# Altium schematic sheet CurrentSense.SchDoc
size A4
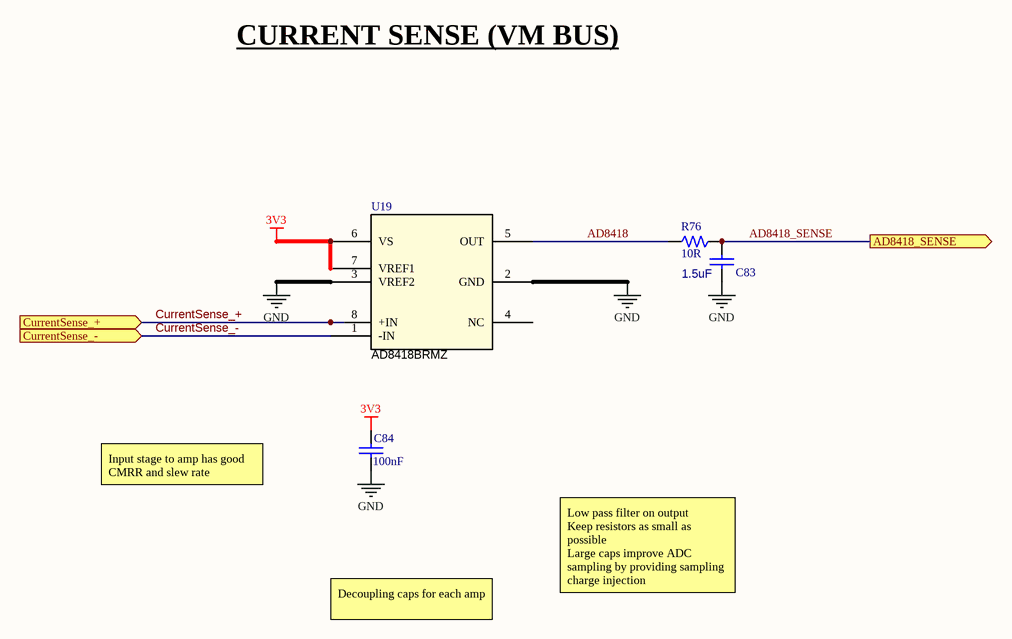
[diagram p0: CurrentSense.SchDoc]

## Parts
C83  Capacitance: 1.5uF  [CAP0402]  (hidden comment: Capacitor)
C84  Capacitance: 100nF  [CAP0402]  (hidden comment: Capacitor)
R76  Resistance: 10R  [RES0402]  (hidden comment: Resistor)
U19  Current Sense  [AD8418BRMZ]  (value not drawn)

## Ports
AD8418_SENSE (out), CurrentSense_+ (in), CurrentSense_- (in)

## Nets
3V3: C84.1 U19.6(VS) U19.7(VREF1)
GND: C83.2 C84.2 U19.2(GND) U19.3(VREF2)
AD8418: R76.2 U19.5(OUT)
AD8418_SENSE: C83.1 R76.1 ; port AD8418_SENSE
CurrentSense_+: U19.8(+IN) ; port CurrentSense_+
CurrentSense_-: U19.1(-IN) ; port CurrentSense_-

Not connected (* = marked no-connect by the designer): U19 4(NC)

## Notes on the sheet
- CURRENT SENSE (VM BUS)
- Input stage to amp has good CMRR and slew rate
- Decoupling caps for each amp
- Low pass filter on output
  Keep resistors as small as possible
  Large caps improve ADC sampling by providing sampling charge injection

## Library data of the parts
C83 = Capacitor: CAP CER 1.5UF 35V X5R 0402; Manufacturer 1: TDK; Manufacturer Part Number 1: C1005X5R1V155K050BC; Dielectric Material: Ceramic; Manufacturer: *; Manufacturer Part Number: *; Supplier: *; Supplier Part Number: *; Tolerance: *; Voltage: *; Footprint: *; Temperature Coefficient: *; Supplier 1: Digi-Key; Supplier Part Number 1: 445-13860-1-ND; RoHS: Yes; Category: Ceramic Capacitors; Stock 1: 9270; Pricing 1: 1=0,37000, 10=0,25800, 50=0,18100, 100=0,15510, 500=0,11632, 1000=0,09823, 2500=0,09306, 5000=0,08789 (USD); Mount: Surface Mount; Case/Package: 0402; Case Code (Metric): 1005; Case Code (Imperial): 0402; Weight: 0.001199oz; Min Operating Temperature: -55°C; Max Operating Temperature: 85°C; Package Quantity: 10000; Packaging: Tape and Reel; Voltage Rating: 35V; Dielectric: X5R; Termination: SMD/SMT; Resistor Type: Ceramic; Voltage Rating (DC): 35V; Series: C; Length: 0.039inch; Width: 0.5mm; Height: 0.5mm; Thickness: 0.022inch; Lead Free: Lead Free; RoHS Compliant: Yes; ComponentLink1URL: https://datasheet.ciiva.com/14896/tdkmlcccaprange-14896024.pdf?src-supplier=Digi-Key; ComponentLink1Description: https://datasheet.ciiva.com/14896/tdkmlcccaprange-14896024.pdf?src-supplier=Digi-Key; ComponentLink2URL: https://datasheet.ciiva.com/14896/tdkmlcccaprange-14896026.pdf?src-supplier=Digi-Key; ComponentLink2Description: https://datasheet.ciiva.com/14896/tdkmlcccaprange-14896026.pdf?src-supplier=Digi-Key; ComponentLink3URL: https://datasheet.ciiva.com/14896/tdkmlcccaprange-14896025.pdf?src-supplier=Digi-Key; ComponentLink3Description: https://datasheet.ciiva.com/14896/tdkmlcccaprange-14896025.pdf?src-supplier=Digi-Key
C84 = Capacitor: Manufacturer: TDK; Manufacturer Part Number: CGA2B3X7R1H104K050BB; Voltage Rating: 50V; Tolerance: 10%; Dielectric: X7R; Supplier 1: Digi-Key; Supplier Part Number 1: 445-6899-1-ND; Stock 1: 14098587; Mount: Surface Mount; Case/Package: 0402; Weight: 2.3E-05oz; Case Code (Metric): 1005; Case Code (Imperial): 0402; Min Operating Temperature: -55°C; Max Operating Temperature: 125°C; Packaging: Tape and Reel; Package Quantity: 1; Voltage Rating (DC): 50V; Termination: SMD/SMT; Composition: Ceramic; Voltage: 50V; Length: 1mm; Height: 0.5mm; Width: 0.02inch; Thickness: 0.022inch; Depth: 0.5mm; Ratings: AEC-Q200; REACH SVHC: No SVHC; Lead Free: Lead Free; ComponentLink1URL: http://product.tdk.com/capacitor/mlcc/en/documents/mlccspec_automotive_general_midvoltage_en.pdf?src-supplier=Future+Electronics; ComponentLink1Description: http://product.tdk.com/capacitor/mlcc/en/documents/mlccspec_automotive_general_midvoltage_en.pdf?src-supplier=Future+Electronics; ComponentLink2URL: http://www.farnell.com/datasheets/1807242.pdf?src-supplier=Element14; ComponentLink2Description: http://www.farnell.com/datasheets/1807242.pdf?src-supplier=Element14; ComponentLink3URL: http://www.mouser.com/ds/2/400/lcc_automotive_general_en-843974.pdf?src-supplier=Mouser; ComponentLink3Description: http://www.mouser.com/ds/2/400/lcc_automotive_general_en-843974.pdf?src-supplier=Mouser; ComponentLink4URL: http://www.farnell.com/datasheets/1936565.pdf?src-supplier=Element14; ComponentLink4Description: http://www.farnell.com/datasheets/1936565.pdf?src-supplier=Element14; ComponentLink5URL: http://www.farnell.com/datasheets/1735392.pdf?src-supplier=Element14; ComponentLink5Description: http://www.farnell.com/datasheets/1735392.pdf?src-supplier=Element14
R76 = Resistor: Manufacturer 1: Panasonic; Manufacturer Part Number 1: ERJ-2RKF10R0X; Tolerance: 1%; Temperature Coefficient: 100ppm/°C; Power Rating: 100mW; Voltage Rating: 50V; Supplier 1: Digi-Key; Supplier Part Number 1: P10.0LDKR-ND; Stock 1: 5683093; Pricing 1: 1=0,10000, 10=0,04800, 100=0,01960, 1000=0,00882, 2500=0,00766, 5000=0,00633 (USD); RoHS: Yes; Mount: Surface Mount; Case/Package: 0402; Number of Pins: 2; Contact Plating: Tin; Case Code (Imperial): 0402; Case Code (Metric): 1005; Min Operating Temperature: -55°C; Max Operating Temperature: 155°C; Composition: Thick Film; Packaging: Tape and Reel; Package Quantity: 1; Termination: SMD/SMT; Number of Terminations: 2; Military Standard: Not; Max Power Dissipation: 100mW; Voltage Rating (DC): 50V; Features: Automotive AEC-Q200; Length: 1mm; Height: 0.35mm; Width: 0.5mm; Depth: 0.5mm; Radiation Hardening: No; REACH SVHC: No SVHC; Lead Free: Lead Free; ComponentLink1URL: https://datasheet.ciiva.com/11821/0900766b80f80784-11821168.pdf?src-supplier=RSComponents; ComponentLink1Description: https://datasheet.ciiva.com/11821/0900766b80f80784-11821168.pdf?src-supplier=RSComponents; ComponentLink2URL: https://datasheet.ciiva.com/7802/aoa0000ce2-7802405.pdf?src-supplier=Element14; ComponentLink2Description: https://datasheet.ciiva.com/7802/aoa0000ce2-7802405.pdf?src-supplier=Element14; ComponentLink3URL: https://datasheet.ciiva.com/16773/70260748-16773366.pdf?src-supplier=Allied+Electronics; ComponentLink3Description: https://datasheet.ciiva.com/16773/70260748-16773366.pdf?src-supplier=Allied+Electronics; ComponentLink4URL: https://datasheet.ciiva.com/43467/1678782-43467127.pdf?src-supplier=Farnell; ComponentLink4Description: https://datasheet.ciiva.com/43467/1678782-43467127.pdf?src-supplier=Farnell; ComponentLink5URL: https://datasheet.ciiva.com/9194/aoa0000ce2-9194120.pdf?src-supplier=Avnet; ComponentLink5Description: https://datasheet.ciiva.com/9194/aoa0000ce2-9194120.pdf?src-supplier=Avnet; ComponentLink6URL: https://datasheet.ciiva.com/30218/aoa0000ce2-30218536.pdf?src-supplier=Onlinecomponents.com; ComponentLink6Description: https://datasheet.ciiva.com/30218/aoa0000ce2-30218536.pdf?src-supplier=Onlinecomponents.com; ComponentLink7URL: https://datasheet.ciiva.com/17212/aoa0000ce2-17212057.pdf?src-supplier=Avnet+Europe; ComponentLink7Description: https://datasheet.ciiva.com/17212/aoa0000ce2-17212057.pdf?src-supplier=Avnet+Europe; ComponentLink8URL: https://datasheet.ciiva.com/24071/aoa0000ce2-24071514.pdf?src-supplier=Mouser; ComponentLink8Description: https://datasheet.ciiva.com/24071/aoa0000ce2-24071514.pdf?src-supplier=Mouser; ComponentLink9URL: https://datasheet.ciiva.com/27055/1987054-27055644.pdf?src-supplier=Jameco; ComponentLink9Description: https://datasheet.ciiva.com/27055/1987054-27055644.pdf?src-supplier=Jameco; ComponentLink10URL: https://datasheet.ciiva.com/6082/aoa0000ce2-6082046.pdf?src-supplier=Farnell; ComponentLink10Description: https://datasheet.ciiva.com/6082/aoa0000ce2-6082046.pdf?src-supplier=Farnell; ComponentLink11URL: https://datasheet.ciiva.com/22668/1678782-22668302.pdf?src-supplier=Element14; ComponentLink11Description: https://datasheet.ciiva.com/22668/1678782-22668302.pdf?src-supplier=Element14
U19 = AD8418BRMZ: Current Sense Amplifier; Manufacturer: Analog Devices Inc; Manufacturer Part Number: AD8418BRMZ; Supplier: Digi-Key; Supplier Part Number: AD8418BRMZ-ND; Price: 3.50; Component Type: Current Sense Amplifier 1 Circuit 8-MSOP